# EAGLE design wołek (EAGLE 7.7.0)
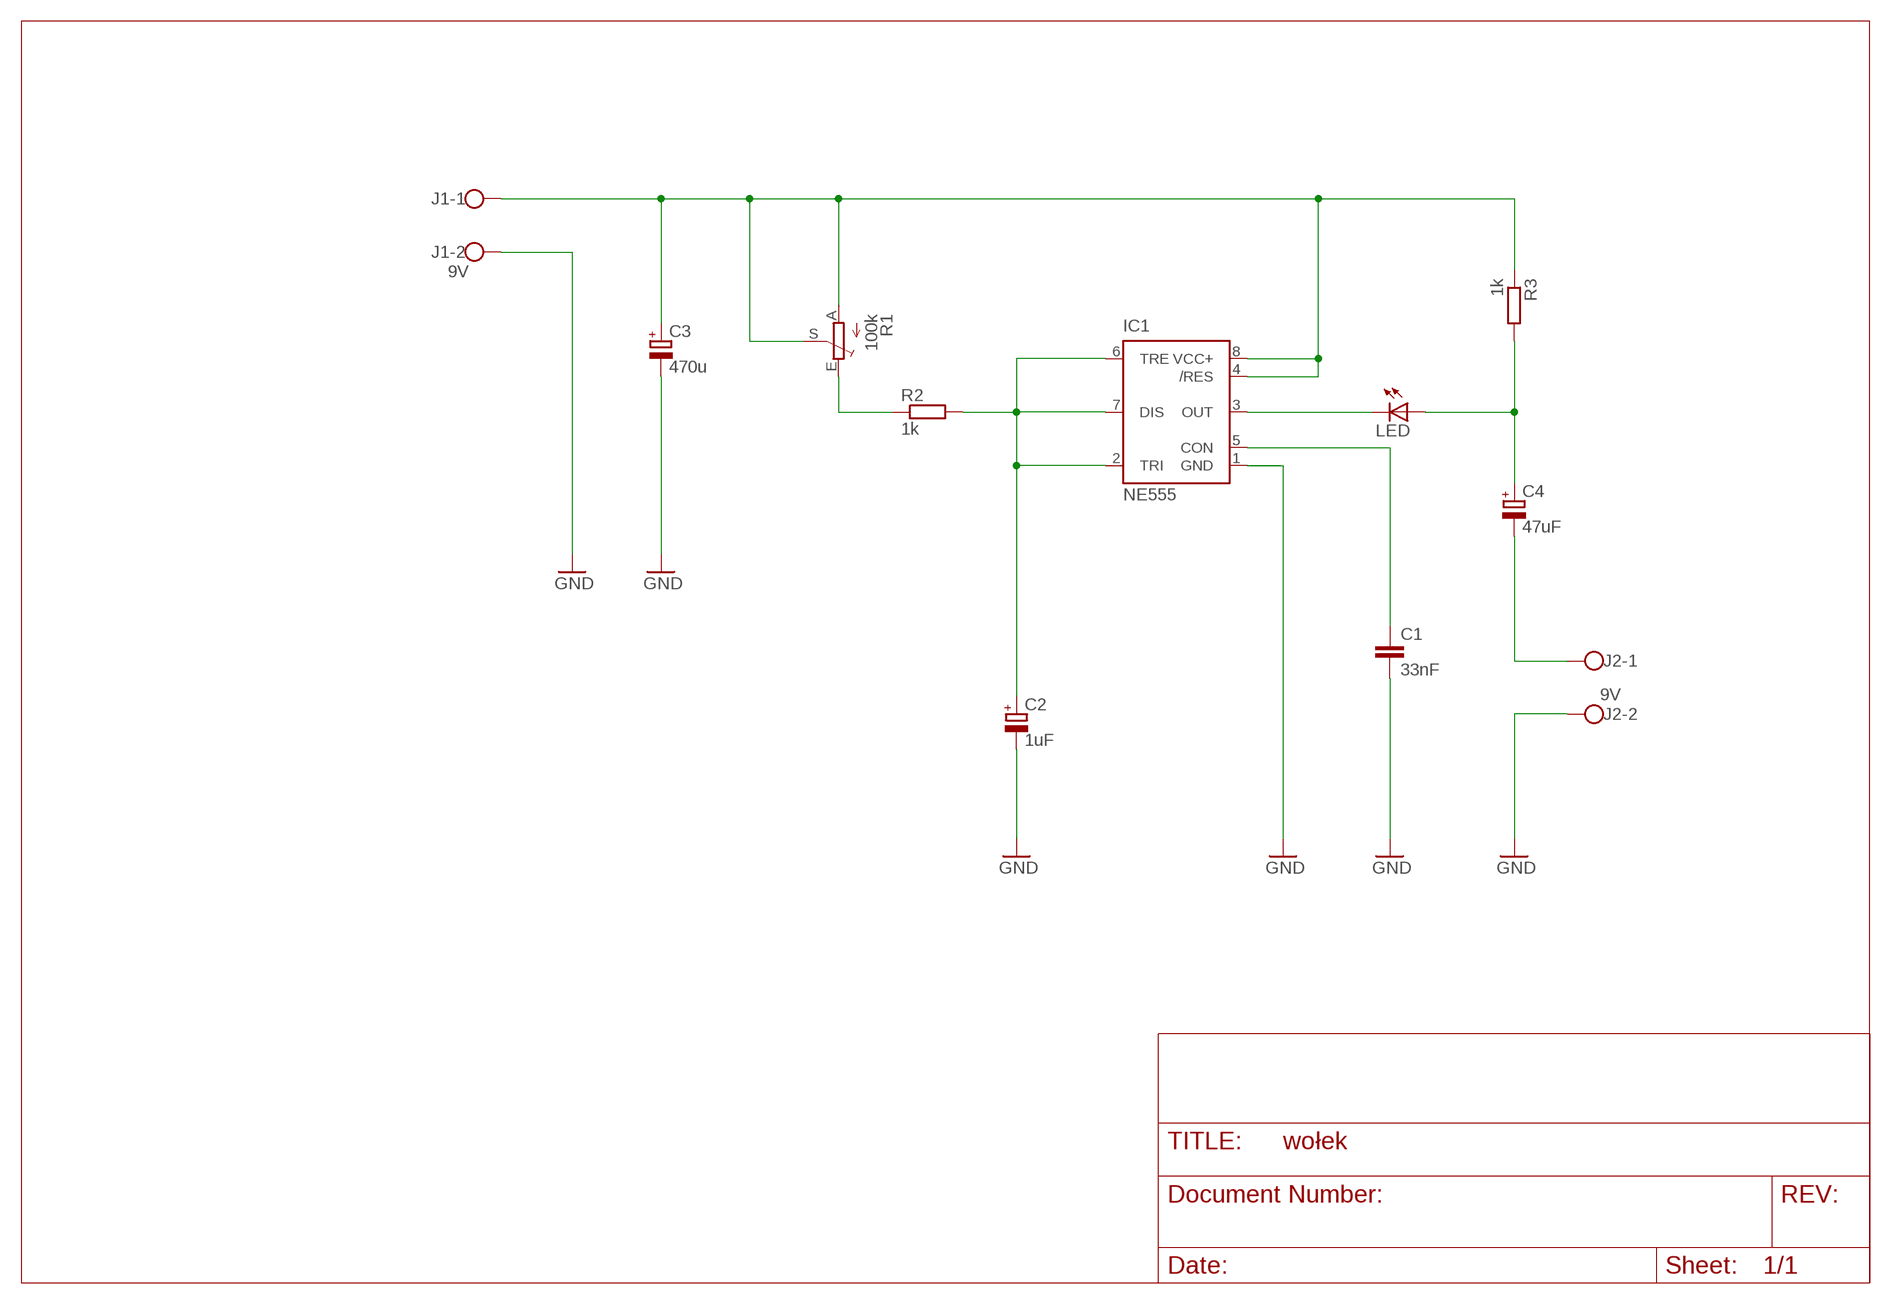
[diagram p0: schematic, sheet 1]

## Parts
C1  33nF  C-EUC1206K  [C1206K]
C2  1uF  CPOL-EUE5-8.5  [E5-8,5]
C3  470u  CPOL-EUE7.5-16  [E7,5-16]
C4  47uF  CPOL-EUE5-8.5  [E5-8,5]
IC1  NE555  [DIL-08]
J1  9V  W237-102  [W237-102]
J2  9V  W237-102  [W237-102]
LED  LED_LED3MM  [LED_LED3MM]
R1  100k  TRIM_EU-CA6V  [CA6V]
R2  1k  R-EU_R1210W  [R1210W]
R3  1k  R-EU_R1210W  [R1210W]

## Nets
GND: C1.2 C2.- C3.- IC1.1(GND) J1.2 J2.2
N$1: C3.+ IC1.4(/RES) IC1.8(VCC+) J1.1 R1.A R1.S R3.1
N$2: C4.+ LED.A R3.2
N$3: C4.- J2.1
N$5: C2.+ IC1.2(TRI) IC1.6(TRE) IC1.7(DIS) R2.2
N$6: IC1.3(OUT) LED.K(C)
N$7: R1.E R2.1
N$9: C1.1 IC1.5(CON)

## Library data of the parts
C1 = rcl:C-EU: CAPACITOR, European symbol
C2-C4 = rcl:CPOL-EU: POLARIZED CAPACITOR, European symbol
IC1 = st-microelectronics:NE555: General purpose bipolar Timer; MF: Arrow Electronics; MPN: NE555N; OC_FARNELL: 1467742; OC_NEWARK: 89K1486
J1 J2 = con-wago-500:W237-102: WAGO SCREW CLAMP; MPN: 237-102; OC_FARNELL: unknown; OC_NEWARK: 70K9898
LED = diodabiblioteka:LED_LED: LED OSRAM: - CHIPLED LG R971, LG N971, LY N971, LG Q971, LY Q971, LO R971, LY R971 LH N974, LH R974 LS Q976, LO Q976, LY Q976 LO Q996 - Hyper CHIPLED LW Q18S LB Q993, LB Q99A, LB R99A - SideLED LS A670, LO A670, LY A670, LG A670, LP A670 LB A673, LV A673, LT A673, LW A673 LH A674 LY A675 LS A676, LA A676, LO A676, LY A676, LW A676 LS A679, LY A679, LG A679 - Hyper Micro SIDELED® LS Y876, LA Y876, LO Y876, LY Y876 LT Y87S - SmartLED LW L88C, LW L88S LB L89C, LB L89S, LG L890 LS L89K, LO L89K, LY L89K LS L896, LA L896, LO L896, LY L896 - TOPLED LS T670, LO T670, LY T670, LG T670, LP T670 LSG T670, LSP T670, LSY T670, LOP T670, LYG T670 LG T671, LOG T671, LSG T671 LB T673, LV T673, LT T673, LW T673 LH T674 LS T676, LA T676, LO T676, LY T676, LB T676, LH T676, LSB T676, LW T676 LB T67C, LV T67C, LT T67C, LS T67K, LO T67K, LY T67K, LW E67C LS E67B, LA E67B, LO E67B, LY E67B, LB E67C, LV E67C, LT E67C LW T67C LS T679, LY T679, LG T679 LS T770, LO T770, LY T770, LG T770, LP T770 LB T773, LV T773, LT T773, LW T773 LH T774 LS E675, LA E675, LY E675, LS T675 LS T776, LA T776, LO T776, LY T776, LB T776 LHGB T686 LT T68C, LB T68C - Hyper Mini TOPLED® LB M676 - Mini TOPLED Santana® LG M470 LS M47K, LO M47K, LY M47K Source: http://www.osram.convergy.de LUXEON: - LUMILED® LXK2-PW12-R00, LXK2-PW12-S00, LXK2-PW14-U00, LXK2-PW14-V00 LXK2-PM12-R00, LXK2-PM12-S00, LXK2-PM14-U00 LXK2-PE12-Q00, LXK2-PE12-R00, LXK2-PE12-S00, LXK2-PE14-T00, LXK2-PE14-U00 LXK2-PB12-K00, LXK2-PB12-L00, LXK2-PB12-M00, LXK2-PB14-N00, LXK2-PB14-P00, LXK2-PB14-Q00 LXK2-PR12-L00, LXK2-PR12-M00, LXK2-PR14-Q00, LXK2-PR14-R00 LXK2-PD12-Q00, LXK2-PD12-R00, LXK2-PD12-S00 LXK2-PH12-R00, LXK2-PH12-S00 LXK2-PL12-P00, LXK2-PL12-Q00, LXK2-PL12-R00 Source: www.luxeon.com KINGBRIGHT: KA-3528ASYC Source: www.kingbright.com
R1 = pot:TRIM_EU-: POTENTIOMETER
R2 R3 = resistor:R-EU_: RESISTOR, European symbol

## Board
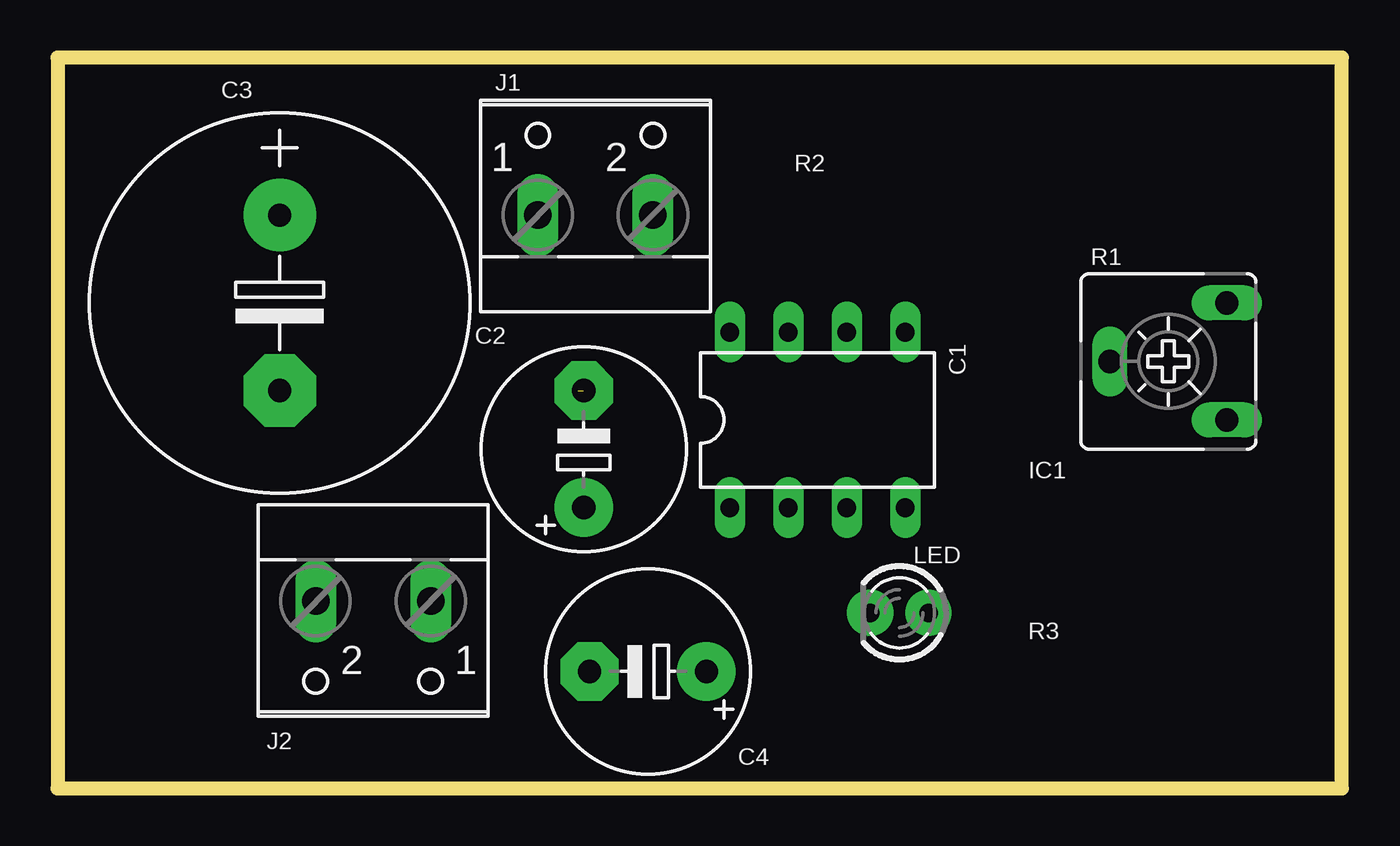
[diagram p1: board, top side]
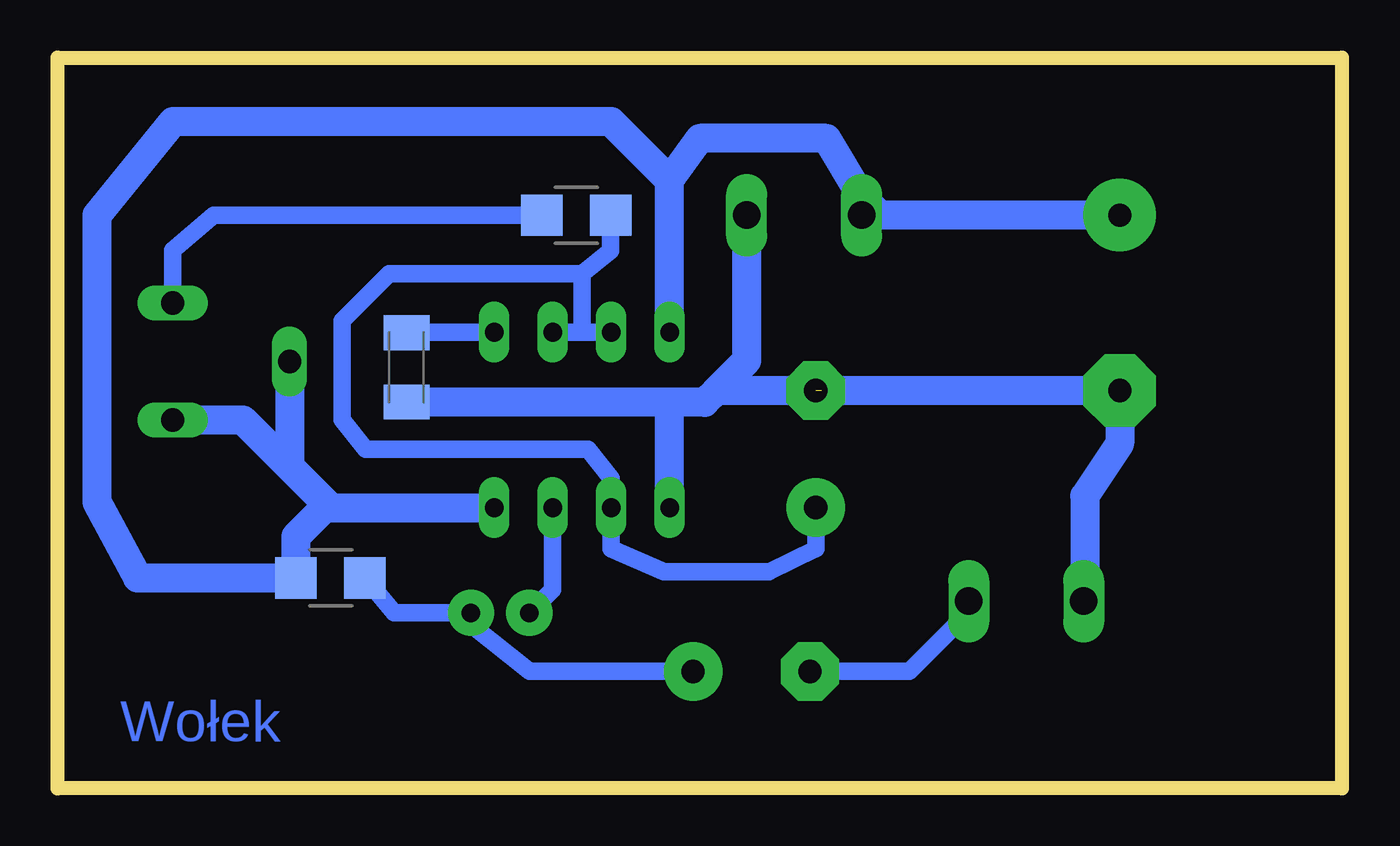
[diagram p2: board, bottom side, seen from below]

Size 55.8 x 31.74 mm. Coordinates in mm from the lower left corner, seen from the top.
Outline: 0,0 55.8,0 55.8,31.74 0,31.74 0,0
Copper layers (1*16): Top 0.035mm / dielectric 1.5mm / Bottom 0.035mm
Design rules "default": minimum track width 10mil, minimum drill 24mil, track to track 8mil, track to pad 8mil, pad to pad 8mil, via to via 8mil, smd to smd 8mil, copper to edge 40mil, drill to drill 8mil, minimum pad ring 10mil, minimum via ring 8mil, stop-mask expansion 4mil, vias tented up to drill 0mil, thermal gap 10mil

### Footprints (pad centres in the part's own frame; a part is rotated, then mirrored left to right if it is on the bottom)
C1206K = smd 1.5 x 2: 1 -1.5,0; 2 1.5,0
E5-8,5 = drill 1.016 pad 2.54: + -2.54,0 | drill 1.016 pad 2.54 octagon: - 2.54,0
E7,5-16 = drill 1.016 pad 3.15: + -3.81,0 | drill 1.016 pad 3.15 octagon: - 3.81,0
DIL-08 = drill 0.813 long: 1 -3.81,-3.81; 2 -1.27,-3.81; 3 1.27,-3.81; 4 3.81,-3.81; 5 3.81,3.81; 6 1.27,3.81; 7 -1.27,3.81; 8 -3.81,3.81
W237-102 = drill 1.194 long: 1 -2.5,-1.27; 2 2.5,-1.27
LED_LED3MM = drill 0.8 pad 2: A -1.27,0; K 1.27,0
CA6V = drill 1.016 long: A -2.54,-2.54; E 2.54,-2.54; S 0,2.54
R1210W = smd 1.8 x 1.8: 1 -1.499,0; 2 1.499,0

### Placement (x,y rotation side)
C1  40.64,18.29 270 bottom
C2  22.86,14.73 90 top
C3  9.65,21.08 270 top
C4  25.65,5.08 180 top
IC1  33.02,16 0 top
J1  23.37,26.16 0 top
J2  13.72,6.86 180 top
LED  36.58,7.62 180 top
R1  48.26,18.54 90 top
R2  33.27,24.89 0 bottom
R3  43.94,9.14 0 bottom

### Tracks (layer width: path | path; a pad name or v marks a point on that pad's centre or on a via)
GND  (1 unrouted)
  Bottom 0.762: 25.61,21.34 25.87,21.08
  Bottom 1.27: 22.61,17.27 C3.- 9.65,14.99 11.18,12.7 11.18,8.17 J2.2 | J1.2 25.87,21.08 25.87,18.58 27.18,17.27 | 29.21,16.76 27.69,16.76 27.18,17.27 | IC1.1 29.21,16.76 | C1.2 29.21,16.79 29.21,16.76 | C2.- 27.18,17.27
N$1
  Bottom 0.762: 44.07,12.32 43.94,12.19
  Bottom 1.27: IC1.8 29.21,26.42 | 29.21,26.42 31.75,28.96 50.8,28.96 54.1,24.89 54.1,12.45 52.32,9.14 R3.1 45.44,10.95 44.07,12.32 45.72,13.97 | C3.+ 20.07,24.89 | 20.07,24.89 J1.1 | R1.S 45.72,13.97 | 43.94,12.19 IC1.4 | R1.A 47.75,16 45.72,13.97 | 29.21,26.42 27.9,28.23 22.39,28.23 20.87,25.69 20.07,24.89
N$2
  Bottom 0.762: R3.2 41.17,7.62 LED.A 37.85,7.11 35.31,5.08 C4.+
N$3
  Bottom 0.762: J2.1 16.72,7.15 18.8,5.08 C4.-
N$5
  Bottom 0.762: IC1.7 33.02,19.81 | 33.02,19.81 IC1.6 | R2.2 31.77,23.34 33.02,22.35 | 33.02,22.35 41.4,22.35 43.43,20.32 43.43,16 42.42,14.73 32.77,14.73 31.75,13.46 IC1.2 31.75,10.41 29.46,9.4 24.89,9.4 22.86,10.41 C2.+ | 33.02,22.35 33.02,19.81
N$6
  Bottom 0.762: IC1.3 34.29,8.64 LED.K
N$7
  Bottom 0.762: R2.1 49.02,24.89 50.8,23.37 R1.E
N$9
  Bottom 0.762: 40.36,19.84 C1.1 40.64,19.81 IC1.5

### Text on the board
Bottom: Wołek